# EAGLE design P2O-001 (EAGLE 7.1.0)
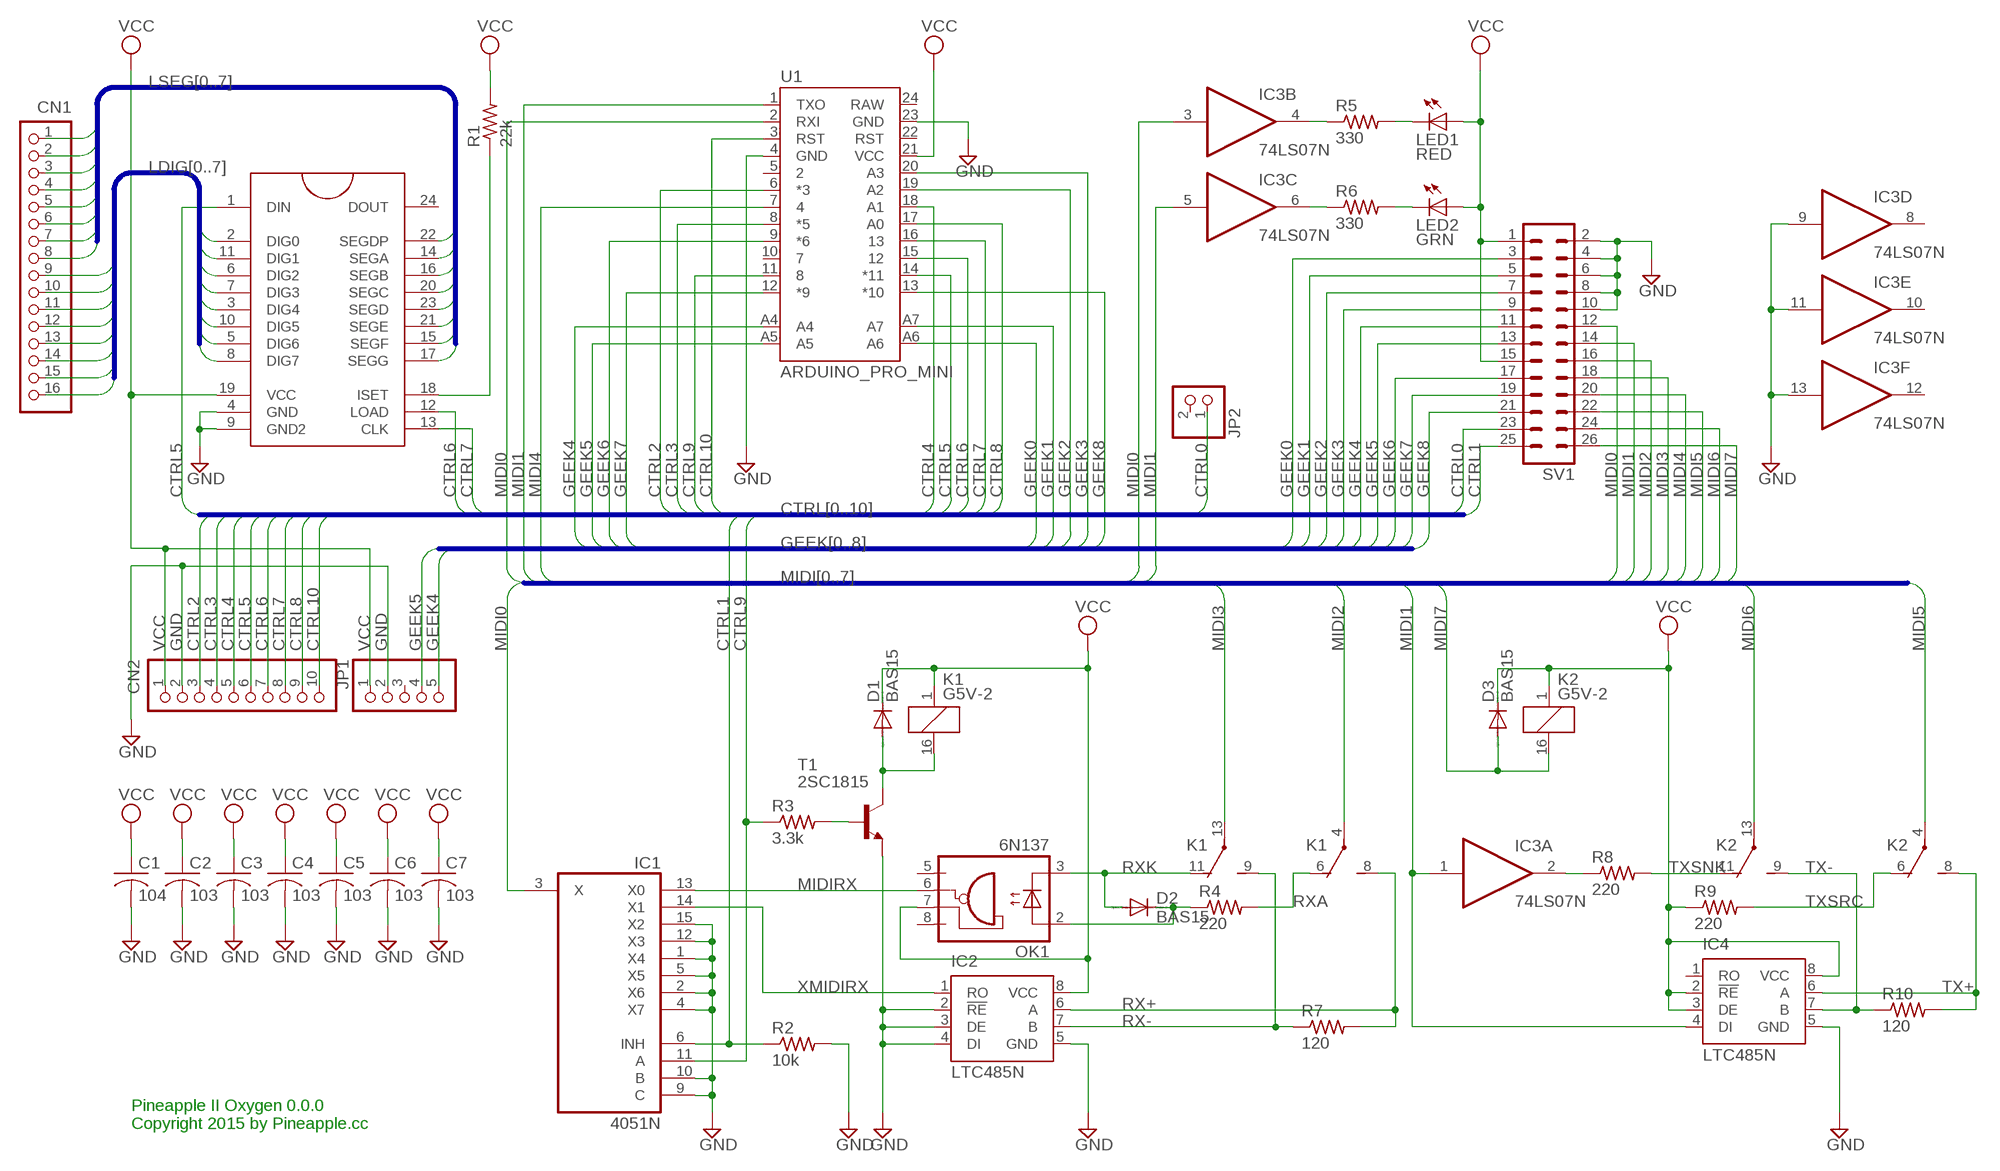
[diagram p0: schematic, sheet 1]

## Parts
C1  104  C-US025-025X050  [C025-025X050]
C2  103  C-US025-025X050  [C025-025X050]
C3  103  C-US025-025X050  [C025-025X050]
C4  103  C-US025-025X050  [C025-025X050]
C5  103  C-US025-025X050  [C025-025X050]
C6  103  C-US025-025X050  [C025-025X050]
C7  103  C-US025-025X050  [C025-025X050]
CN1  S16B-PH-K-S  [S16B-PH-K-S]
CN2  S10B-PH-K-S  [S10B-PH-K-S]
D1  BAS15  [DO34-7]
D2  BAS15  [DO34-7]
D3  BAS15  [DO34-7]
IC1  4051N  [DIL16]
IC2  LTC485N  [DIL08]
IC3  74LS07N  [DIL14]
IC4  LTC485N  [DIL08]
JP1  PINHD-1X5  [1X05]
JP2  PINHD-1X2  [1X02]
K1  G5V-2  [G5V-2]
K2  G5V-2  [G5V-2]
LED1  RED  LED3MM  [LED3MM]
LED2  GRN  LED3MM  [LED3MM]
OK1  6N137  [DIL08]
R1  22k  R-US_0204/5  [0204/5]
R2  10k  R-US_0204/5  [0204/5]
R3  3.3k  R-US_0204/5  [0204/5]
R4  220  R-US_0204/5  [0204/5]
R5  330  R-US_0204/5  [0204/5]
R6  330  R-US_0204/5  [0204/5]
R7  120  R-US_0204/5  [0204/5]
R8  220  R-US_0204/5  [0204/5]
R9  220  R-US_0204/5  [0204/5]
R10  120  R-US_0204/5  [0204/5]
SV1  ML26L  [ML26L]
T1  2SC1815  [TO92-ECB]
U1  ARDUINO_PRO_MINI  [ARDUINO_PRO_MINI]
U2  MAX7219DIP  [DIL24]

## Nets
CTRL0: JP2.1 SV1.23
CTRL1: IC1.6(INH) R2.1 SV1.25
CTRL2: CN2.3 U1.6(*3)
CTRL3: CN2.4 U1.8(*5)
CTRL4: CN2.5 U1.18(A1)
CTRL5: CN2.6 U1.14(*11) U2.1(DIN)
CTRL6: CN2.7 U1.15 U2.12(LOAD)
CTRL7: CN2.8 U1.16 U2.13(CLK)
CTRL8: CN2.9 U1.17(A0)
CTRL9: IC1.11(A) R3.1 U1.11
CTRL10: CN2.10 U1.3(RST)
GEEK0: SV1.3 U1.A6
GEEK1: SV1.5 U1.A7
GEEK2: SV1.7 U1.19(A2)
GEEK3: SV1.9 U1.20(A3)
GEEK4: JP1.5 SV1.11 U1.A4
GEEK5: JP1.4 SV1.13 U1.A5
GEEK6: SV1.17 U1.9(*6)
GEEK7: SV1.19 U1.12(*9)
GEEK8: SV1.21 U1.13(*10)
GND: C1.2 C2.2 C3.2 C4.2 C5.2 C6.2 C7.2 CN2.2 IC1.1(X4) IC1.2(X6) IC1.4(X7) IC1.5(X5) IC1.9(C) IC1.10(B) IC1.12(X3) IC1.15(X2) IC2.2(!RE) IC2.3(DE) IC2.4(DI) IC2.5(GND) IC3.9(D:I) IC3.11(E:I) IC3.13(F:I) IC4.5(GND) JP1.2 R2.2 SV1.2 SV1.4 SV1.6 SV1.8 SV1.10 T1.E U1.4(GND) U1.23(GND) U2.4(GND) U2.9(GND2)
LDIG0: CN1.9 U2.2(DIG0)
LDIG1: CN1.10 U2.11(DIG1)
LDIG2: CN1.11 U2.6(DIG2)
LDIG3: CN1.12 U2.7(DIG3)
LDIG4: CN1.13 U2.3(DIG4)
LDIG5: CN1.14 U2.10(DIG5)
LDIG6: CN1.15 U2.5(DIG6)
LDIG7: CN1.16 U2.8(DIG7)
LSEG0: CN1.1 U2.22(SEGDP)
LSEG1: CN1.2 U2.14(SEGA)
LSEG2: CN1.3 U2.16(SEGB)
LSEG3: CN1.4 U2.20(SEGC)
LSEG4: CN1.5 U2.23(SEGD)
LSEG5: CN1.6 U2.21(SEGE)
LSEG6: CN1.7 U2.15(SEGF)
LSEG7: CN1.8 U2.17(SEGG)
MIDI0: IC1.3(X) IC3.3(B:I) SV1.12 U1.2(RXI)
MIDI1: IC3.1(A:I) IC3.5(C:I) IC4.4(DI) SV1.14 U1.1(TXO)
MIDI2: K1.4(1:P) SV1.16
MIDI3: K1.13(2:P) SV1.18
MIDI4: SV1.20 U1.7
MIDI5: K2.4(1:P) SV1.22
MIDI6: K2.13(2:P) SV1.24
MIDI7: D3.A K2.16 SV1.26
MIDIRX: IC1.13(X0) OK1.6(VO)
N$1: R3.2 T1.B
N$2: IC3.2(A:O) R8.1
N$3: IC3.4(B:O) R5.1
N$4: IC3.6(C:O) R6.1
N$5: LED1.K(C) R5.2
N$6: LED2.K(C) R6.2
N$11: D1.A K1.16 T1.C
N$13: D2.C OK1.2(A) R4.1
N$21: R1.1 U2.18(ISET)
RX+: IC2.6(A) K1.8(1:S) R7.2
RX-: IC2.7(B) K1.9(2:S) R7.1
RXA: K1.6(1:O) R4.2
RXK: D2.A K1.11(2:O) OK1.3(C)
TX+: IC4.6(A) K2.8(1:S) R10.2
TX-: IC4.7(B) K2.9(2:S) R10.1
TXSNK: K2.11(2:O) R8.2
TXSRC: K2.6(1:O) R9.2
VCC: C1.1 C2.1 C3.1 C4.1 C5.1 C6.1 C7.1 CN2.1 D1.C D3.C IC2.8(VCC) IC4.2(!RE) IC4.3(DE) IC4.8(VCC) JP1.1 K1.1 K2.1 LED1.A LED2.A OK1.7(VE) R1.2 R9.1 SV1.1 SV1.15 U1.21(VCC) U2.19(VCC)
XMIDIRX: IC1.14(X1) IC2.1(RO)
Unconnected: IC3.8(D:O) IC3.10(E:O) IC3.12(F:O) IC4.1(RO) JP1.3 JP2.2 OK1.5(GND) OK1.8(VCC) U1.5 U1.10 U1.22(RST) U1.24(RAW) U2.24(DOUT)

## Buses
GEEK[0..8]
LSEG[0..7]
LDIG[0..7]
CTRL[0..10]
MIDI[0..7]

## Notes on the sheet
- Pineapple II Oxygen 0.0.0
  Copyright 2015 by Pineapple.cc

## Power pins joined to a net without a drawn wire
GND: IC1.8(GND) IC3.7(P:GND)
VCC: IC1.16(VCC) IC3.14(P:VCC)
VEE: IC1.7(VEE)

## Library data of the parts
C1-C7 = rcl:C-US: CAPACITOR, American symbol
CN1 = jst-ph:S16B-PH-*: Wire-to-Board 2.0mm pitch side mount connector Source: http://www.jst-mfg.com/product/pdf/jpn/PH.pdf http://www.jst-mfg.com/product/detail.php?series=199
CN2 = jst-ph:S10B-PH-*: Wire-to-Board 2.0mm pitch side mount connector Source: http://www.jst-mfg.com/product/pdf/jpn/PH.pdf http://www.jst-mfg.com/product/detail.php?series=199
D1-D3 = diode:BAS15: DIODE high speed
IC1 = 40xx:4051: 8-channel ANALOG MULTIPLEXER
IC2 IC4 = linear-technology:LTC485: Low Power RS485 Interface Transceiver Source: http://www.linear.com/pc/downloadDocument.do?navId=H0,C1,C1007,C1017,P2064,D1718; OC_FARNELL: unknown; OC_NEWARK: unknown
IC3 = 74xx-us:74*07: Hex BUFFER, open collector high-voltage output
JP1 = pinhead:PINHD-1X5: PIN HEADER
JP2 = pinhead:PINHD-1X2: PIN HEADER
K1 K2 = relay:G5V-2: OMRON PCB Relay Source: http://www.omron.com/ecb/products/pdf/en-g5v2.pdf; MPN: G5V-2 5DC; OC_FARNELL: 9949488; OC_NEWARK: 78K5703
LED1 LED2 = led:LED: LED OSRAM: - CHIPLED LG R971, LG N971, LY N971, LG Q971, LY Q971, LO R971, LY R971 LH N974, LH R974 LS Q976, LO Q976, LY Q976 LO Q996 - Hyper CHIPLED LW Q18S LB Q993, LB Q99A, LB R99A - SideLED LS A670, LO A670, LY A670, LG A670, LP A670 LB A673, LV A673, LT A673, LW A673 LH A674 LY A675 LS A676, LA A676, LO A676, LY A676, LW A676 LS A679, LY A679, LG A679 - Hyper Micro SIDELED® LS Y876, LA Y876, LO Y876, LY Y876 LT Y87S - SmartLED LW L88C, LW L88S LB L89C, LB L89S, LG L890 LS L89K, LO L89K, LY L89K LS L896, LA L896, LO L896, LY L896 - TOPLED LS T670, LO T670, LY T670, LG T670, LP T670 LSG T670, LSP T670, LSY T670, LOP T670, LYG T670 LG T671, LOG T671, LSG T671 LB T673, LV T673, LT T673, LW T673 LH T674 LS T676, LA T676, LO T676, LY T676, LB T676, LH T676, LSB T676, LW T676 LB T67C, LV T67C, LT T67C, LS T67K, LO T67K, LY T67K, LW E67C LS E67B, LA E67B, LO E67B, LY E67B, LB E67C, LV E67C, LT E67C LW T67C LS T679, LY T679, LG T679 LS T770, LO T770, LY T770, LG T770, LP T770 LB T773, LV T773, LT T773, LW T773 LH T774 LS E675, LA E675, LY E675, LS T675 LS T776, LA T776, LO T776, LY T776, LB T776 LHGB T686 LT T68C, LB T68C - Hyper Mini TOPLED® LB M676 - Mini TOPLED Santana® LG M470 LS M47K, LO M47K, LY M47K Source: http://www.osram.convergy.de LUXEON: - LUMILED® LXK2-PW12-R00, LXK2-PW12-S00, LXK2-PW14-U00, LXK2-PW14-V00 LXK2-PM12-R00, LXK2-PM12-S00, LXK2-PM14-U00 LXK2-PE12-Q00, LXK2-PE12-R00, LXK2-PE12-S00, LXK2-PE14-T00, LXK2-PE14-U00 LXK2-PB12-K00, LXK2-PB12-L00, LXK2-PB12-M00, LXK2-PB14-N00, LXK2-PB14-P00, LXK2-PB14-Q00 LXK2-PR12-L00, LXK2-PR12-M00, LXK2-PR14-Q00, LXK2-PR14-R00 LXK2-PD12-Q00, LXK2-PD12-R00, LXK2-PD12-S00 LXK2-PH12-R00, LXK2-PH12-S00 LXK2-PL12-P00, LXK2-PL12-Q00, LXK2-PL12-R00 Source: www.luxeon.com KINGBRIGHT: KA-3528ASYC Source: www.kingbright.com
OK1 = optocoupler:6N137: MOTOROLA OPTO COUPLER; MPN: 6N137; OC_FARNELL: 1328376; OC_NEWARK: 52M1895
R1-R10 = resistor:R-US_: RESISTOR, American symbol
SV1 = con-ml:ML26L: HARTING; OC_FARNELL: unknown; OC_NEWARK: unknown
T1 = transistor:2SC1815: NPN EPITAXIAL TRANSISTOR Source: TOSHIBA .. 2SC1815 1.pdf
U1 = SparkFun-Boards:ARDUINO_PRO_MINI
U2 = SparkFun-DigitalIC:MAX7219: 8-digit, 8-segment LED display driver, serial input

## Board
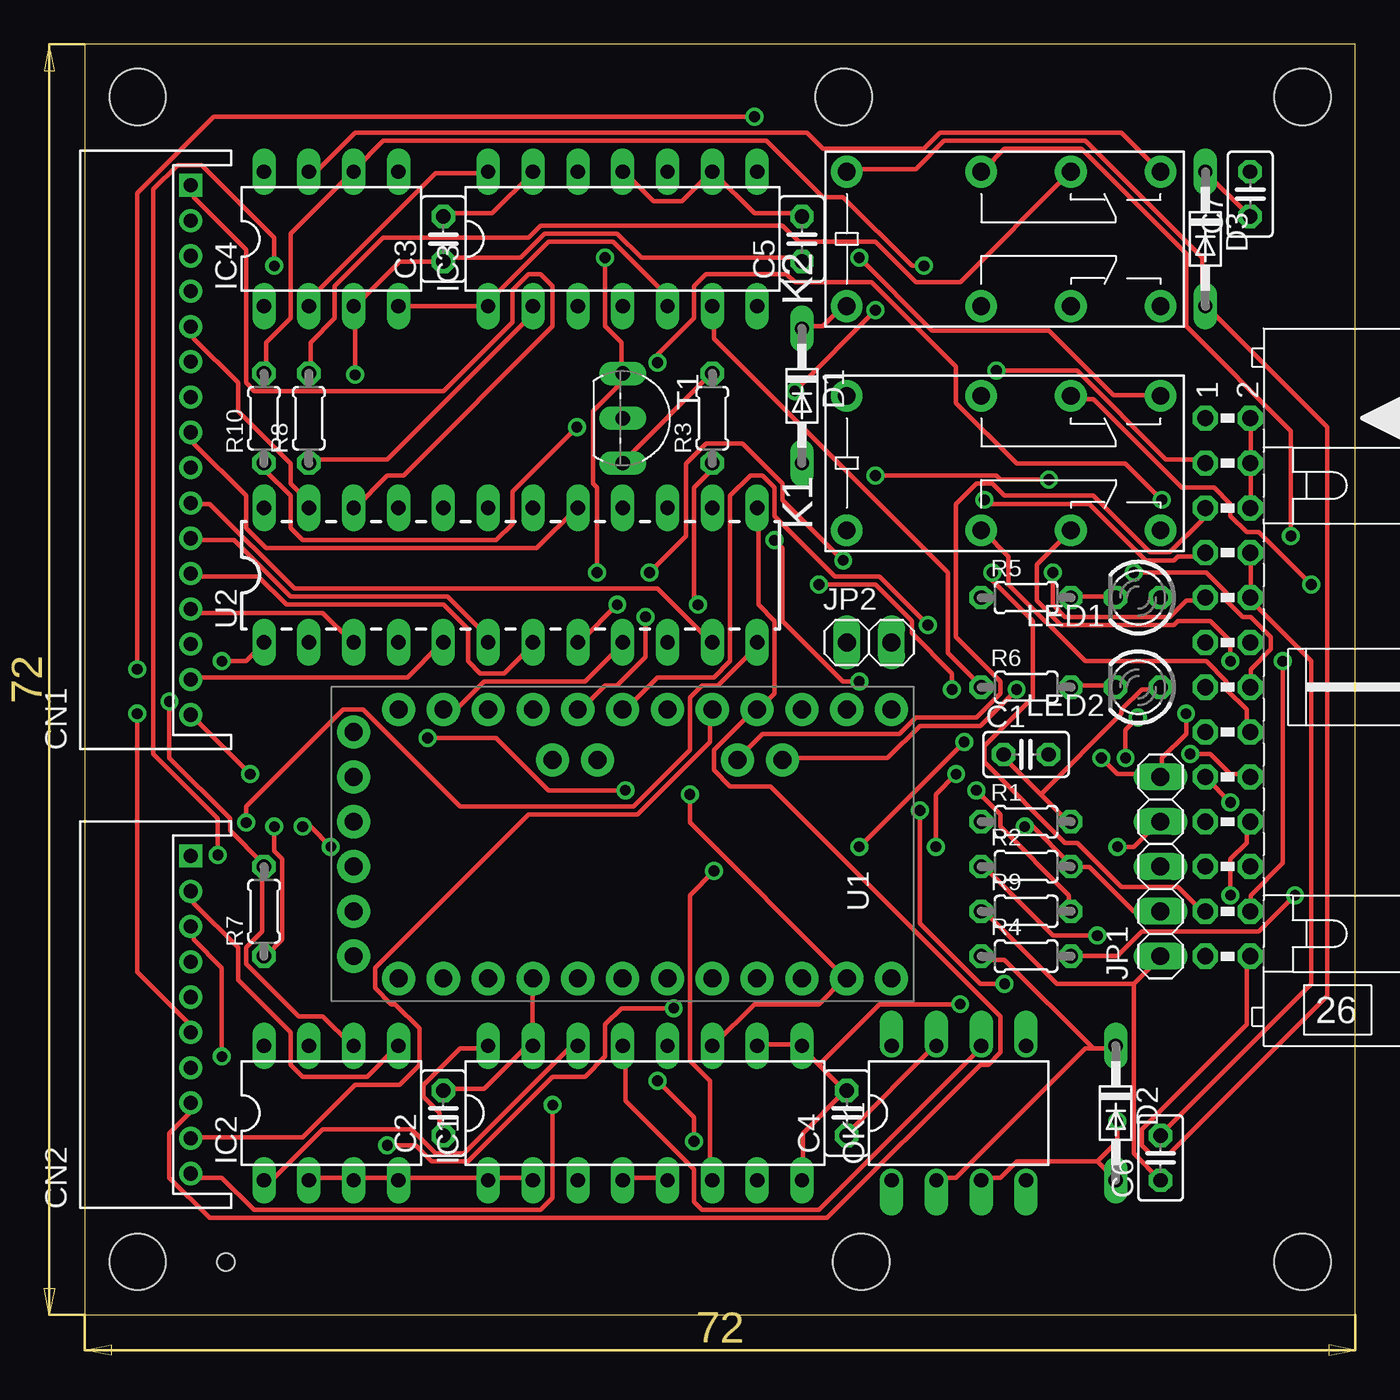
[diagram p1: board, top side]
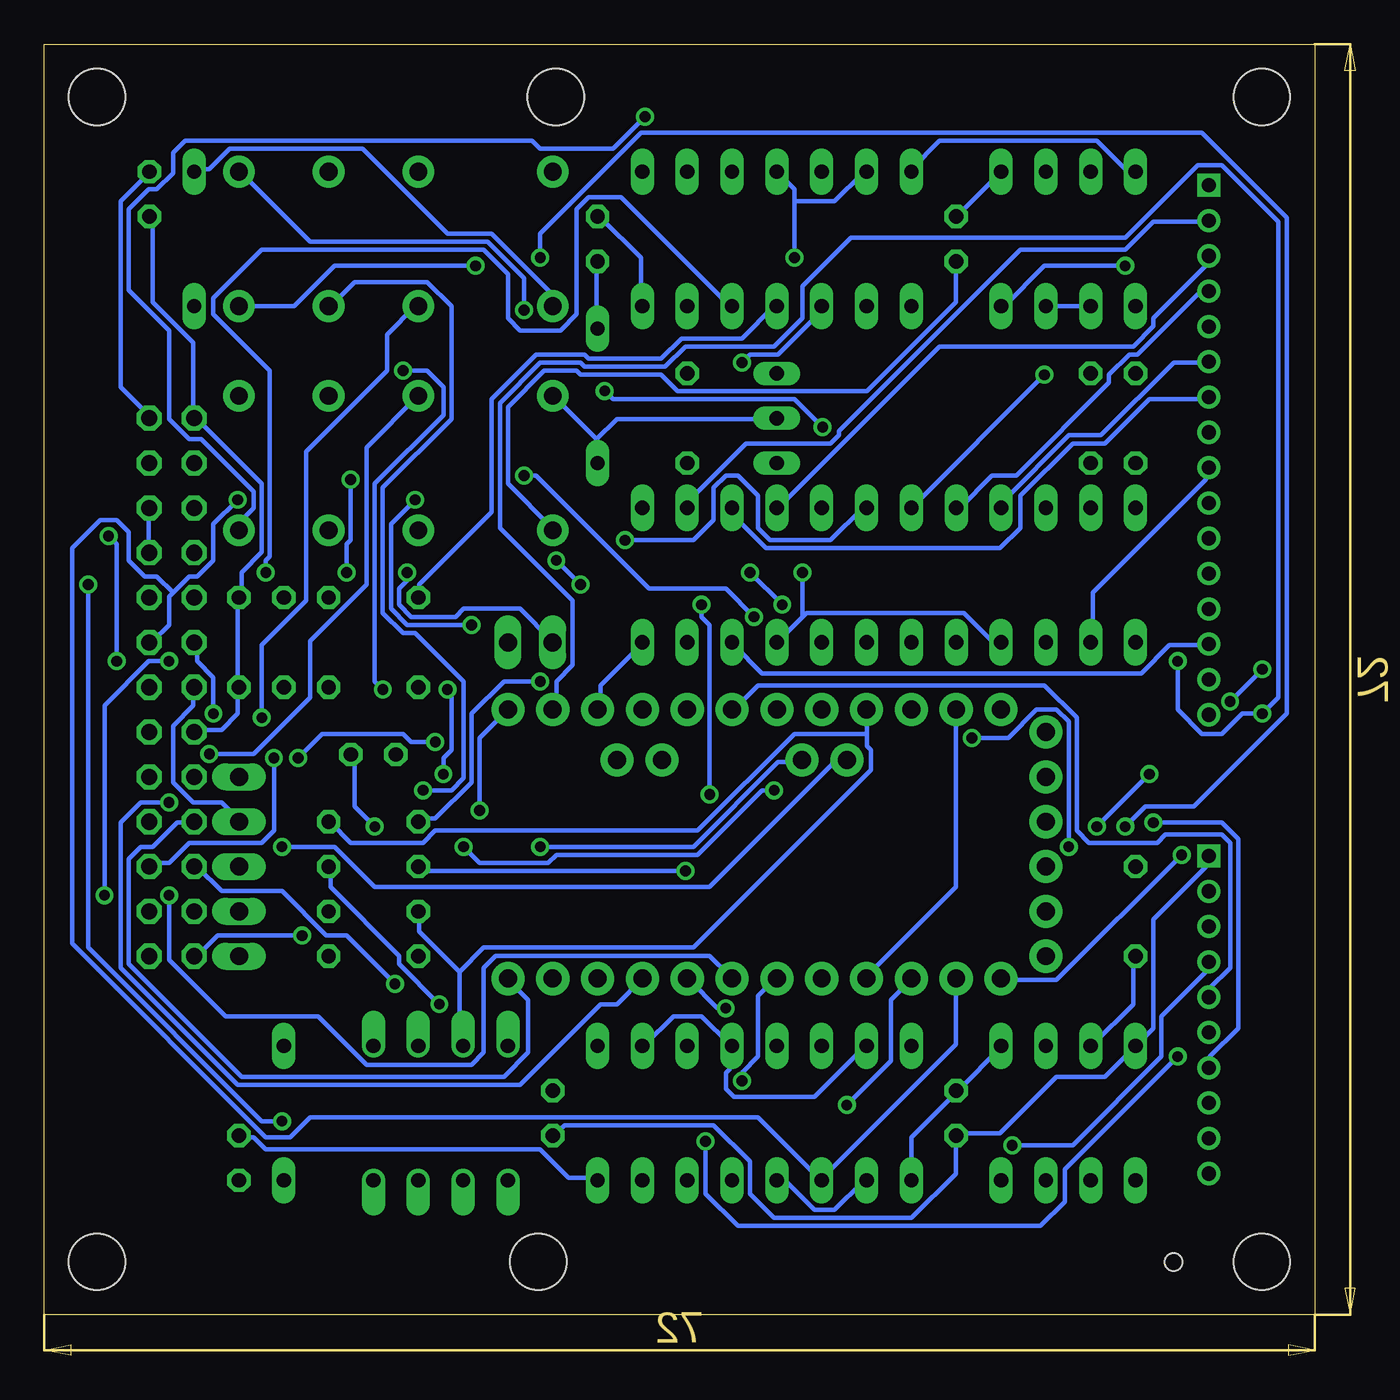
[diagram p2: board, bottom side, seen from below]

Size 72 x 72 mm. Coordinates in mm from the lower left corner, seen from the top.
Outline: 0,0 72,0 72,72 0,72 0,0
Copper layers (1*16): Top 0.035mm / dielectric 1.5mm / Bottom 0.035mm
Design rules "default": minimum track width 10mil, minimum drill 24mil, track to track 8mil, track to pad 8mil, pad to pad 8mil, via to via 8mil, smd to smd 8mil, copper to edge 40mil, drill to drill 8mil, minimum pad ring 10mil, minimum via ring 8mil, stop-mask expansion 4mil, vias tented up to drill 0mil, thermal gap 10mil
Holes 3.2 mm at 3,3 3,69 69,3 69,69 44,3 43,69
Holes 1 mm at 8,3

### Footprints (pad centres in the part's own frame; a part is rotated, then mirrored left to right if it is on the bottom)
C025-025X050 = drill 0.813 octagon: 1 -1.27,0; 2 1.27,0
S16B-PH-K-S = drill 0.8 square: 1 15,0 | drill 0.8: 2 13,0; 3 11,0; 4 9,0; 5 7,0; 6 5,0; 7 3,0; 8 1,0; 9 -1,0; 10 -3,0; 11 -5,0; 12 -7,0; 13 -9,0; 14 -11,0; 15 -13,0; 16 -15,0
S10B-PH-K-S = drill 0.8 square: 1 9,0 | drill 0.8: 2 7,0; 3 5,0; 4 3,0; 5 1,0; 6 -1,0; 7 -3,0; 8 -5,0; 9 -7,0; 10 -9,0
DO34-7 = drill 0.813 long: A 3.81,0; C -3.81,0
DIL16 = drill 0.813 long: 1 -8.89,-3.81; 2 -6.35,-3.81; 3 -3.81,-3.81; 4 -1.27,-3.81; 5 1.27,-3.81; 6 3.81,-3.81; 7 6.35,-3.81; 8 8.89,-3.81; 9 8.89,3.81; 10 6.35,3.81; 11 3.81,3.81; 12 1.27,3.81; 13 -1.27,3.81; 14 -3.81,3.81; 15 -6.35,3.81; 16 -8.89,3.81
DIL08 = drill 0.813 long: 1 -3.81,-3.81; 2 -1.27,-3.81; 3 1.27,-3.81; 4 3.81,-3.81; 5 3.81,3.81; 6 1.27,3.81; 7 -1.27,3.81; 8 -3.81,3.81
DIL14 = drill 0.813 long: 1 -7.62,-3.81; 2 -5.08,-3.81; 3 -2.54,-3.81; 4 0,-3.81; 5 2.54,-3.81; 6 5.08,-3.81; 7 7.62,-3.81; 8 7.62,3.81; 9 5.08,3.81; 10 2.54,3.81; 11 0,3.81; 12 -2.54,3.81; 13 -5.08,3.81; 14 -7.62,3.81
1X05 = drill 1.016 long: 1 -5.08,0; 2 -2.54,0; 3 0,0; 4 2.54,0; 5 5.08,0
1X02 = drill 1.016 long: 1 -1.27,0; 2 1.27,0
G5V-2 = drill 1 pad 1.8: 1 -8.89,-3.81; 4 -1.27,-3.81; 6 3.81,-3.81; 8 8.89,-3.81; 9 8.89,3.81; 11 3.81,3.81; 13 -1.27,3.81; 16 -8.89,3.81
LED3MM = drill 0.813 octagon: A -1.27,0; K 1.27,0
DIL08' = drill 0.813 offset: 1 -3.81,-3.81; 2 -1.27,-3.81; 3 1.27,-3.81; 4 3.81,-3.81; 5 3.81,3.81; 6 1.27,3.81; 7 -1.27,3.81; 8 -3.81,3.81
0204/5 = drill 0.813 octagon: 1 -2.54,0; 2 2.54,0
ML26L = drill 0.914 octagon: 1 -15.24,-1.27; 2 -15.24,1.27; 3 -12.7,-1.27; 4 -12.7,1.27; 5 -10.16,-1.27; 6 -10.16,1.27; 7 -7.62,-1.27; 8 -7.62,1.27; 9 -5.08,-1.27; 10 -5.08,1.27; 11 -2.54,-1.27; 12 -2.54,1.27; 13 0,-1.27; 14 0,1.27; 15 2.54,-1.27; 16 2.54,1.27; 17 5.08,-1.27; 18 5.08,1.27; 19 7.62,-1.27; 20 7.62,1.27; 21 10.16,-1.27; 22 10.16,1.27; 23 12.7,-1.27; 24 12.7,1.27; 25 15.24,-1.27; 26 15.24,1.27
TO92-ECB = drill 0.813 long: B 2.54,0; C 0,0; E -2.54,0
ARDUINO_PRO_MINI = drill 1.016 pad 1.88: 1 -7.62,12.7; 2 -7.62,10.16; 3 -7.62,7.62; 4 -7.62,5.08; 5 -7.62,2.54; 6 -7.62,0; 7 -7.62,-2.54; 8 -7.62,-5.08; 9 -7.62,-7.62; 10 -7.62,-10.16; 11 -7.62,-12.7; 12 -7.62,-15.24; 13 7.62,-15.24; 14 7.62,-12.7; 15 7.62,-10.16; 16 7.62,-7.62; 17 7.62,-5.08; 18 7.62,-2.54; 19 7.62,0; 20 7.62,2.54; 21 7.62,5.08; 22 7.62,7.62; 23 7.62,10.16; 24 7.62,12.7; A4 4.763,1.429; A5 4.763,3.969; A6 4.763,-9.049; A7 4.763,-6.509; BLK -6.35,15.24; GND -3.81,15.24; GRN 6.35,15.24; RXI 1.27,15.24; TXO 3.81,15.24; VCC -1.27,15.24
DIL24 = drill 0.813 long: 1 -13.97,-3.81; 2 -11.43,-3.81; 3 -8.89,-3.81; 4 -6.35,-3.81; 5 -3.81,-3.81; 6 -1.27,-3.81; 7 1.27,-3.81; 8 3.81,-3.81; 9 6.35,-3.81; 10 8.89,-3.81; 11 11.43,-3.81; 12 13.97,-3.81; 13 13.97,3.81; 14 11.43,3.81; 15 8.89,3.81; 16 6.35,3.81; 17 3.81,3.81; 18 1.27,3.81; 19 -1.27,3.81; 20 -3.81,3.81; 21 -6.35,3.81; 22 -8.89,3.81; 23 -11.43,3.81; 24 -13.97,3.81

### Placement (x,y rotation side)
C1  53.34,31.75 0 top
C2  20.32,11.43 90 top
C3  20.32,60.96 90 top
C4  43.18,11.43 90 top
C5  40.64,60.96 90 top
C6  60.96,8.89 90 top
C7  66.04,63.5 90 top
CN1  6,49 90 top
CN2  6,17 90 top
D1  40.64,52.07 270 top
D2  58.42,11.43 270 top
D3  63.5,60.96 270 top
IC1  31.75,11.43 0 top
IC2  13.97,11.43 0 top
IC3  30.48,60.96 0 top
IC4  13.97,60.96 0 top
JP1  60.96,25.4 90 top
JP2  44.45,38.1 0 top
K1  52.07,48.26 0 top
K2  52.07,60.96 0 top
LED1  59.69,40.64 180 top
LED2  59.69,35.56 180 top
OK1  6N137  [DIL08']  49.53,11.43 0 top
R1  53.34,27.94 0 top
R2  53.34,25.4 0 top
R3  35.56,50.8 90 top
R4  53.34,20.32 0 top
R5  53.34,40.64 0 top
R6  53.34,35.56 0 top
R7  10.16,22.86 90 top
R8  12.7,50.8 90 top
R9  53.34,22.86 0 top
R10  10.16,50.8 90 top
SV1  64.77,35.56 270 top
T1  30.48,50.8 270 top
U1  30.48,26.67 90 top
U2  24.13,41.91 0 top

### Tracks (layer width: path | path; a pad name or v marks a point on that pad's centre or on a via)
CTRL0  (via drill 0.61)
  Top 0.254: v51.44,42.06 51.44,41.6 53.72,39.32 53.72,34.98 50.98,32.23 50.98,31.32 55.55,26.75 56.24,26.75 58.75,24.23 61.95,24.23 63.32,22.86 SV1.23
  Bottom 0.254: v51.44,42.06 51.44,41.6 51.89,41.15 51.89,40.23 51.21,39.55 48.69,39.55 48.23,40.01 45.03,40.01 43.2,38.18 JP2.1
CTRL1  (via drill 0.61)
  Top 0.254: v35.66,25.15 34.29,23.77 34.29,14.4 35.43,13.26 35.43,7.77 IC1.6 | v57.38,21.49 54.86,21.49 50.98,25.38 R2.1
  Bottom 0.254: v35.66,25.15 50.52,25.15 50.75,25.38 R2.1 | v57.38,21.49 62.18,21.49 63.32,20.34 SV1.25
CTRL2  (via drill 0.61)
  Top 0.254: v7.77,14.63 7.77,19.66 6.17,21.26 6.17,21.95 CN2.3 | v34.52,9.83 34.52,11.2 v32.46,13.26
  Bottom 0.254: v7.77,14.63 14.17,8.23 14.17,6.4 15.54,5.03 32.69,5.03 34.52,6.86 v34.52,9.83 | v32.46,13.26 32.46,13.72 31.55,14.63 31.55,18.06 30.63,18.97 U1.6
CTRL3  (via drill 0.61)
  Top 0.254: v17.14,9.6 18.75,9.6 19.66,8.69 21.72,8.69 26.52,13.49 28.35,13.49 29.49,14.63 29.49,16.46 30.4,17.37 v33.38,17.37
  Bottom 0.254: v17.14,9.6 13.72,9.6 8.69,14.63 8.69,16.92 6.17,19.43 6.17,19.89 CN2.4 | v33.38,17.37 33.83,17.37 35.43,18.97 U1.8
CTRL4
  Bottom 0.254: CN2.5 5.94,18.06 5.94,18.52 4.8,19.66 4.8,26.75 5.26,27.2 8.46,27.2 8.91,26.75 12.8,26.75 13.49,27.43 13.49,33.83 15.32,35.66 31.55,35.66 32.92,34.29 U1.18
CTRL5  (via drill 0.61)
  Top 0.254: v2.97,34.06 2.97,19.43 5.94,16.46 5.94,16 CN2.6 | v7.77,37.03 9.14,37.03 10.06,37.95 U2.1
  Bottom 0.254: v7.77,37.03 7.77,34.29 6.4,32.92 5.26,32.92 4.12,34.06 v2.97,34.06 2.06,34.98 2.06,61.95 5.26,65.15 6.63,65.15 10.74,61.04 26.29,61.04 29.03,58.29 29.03,56.46 30.63,54.86 35.66,54.86 36.8,53.72 41.38,53.72 41.6,53.95 43.89,53.95 46.18,51.66 46.18,44.58 42.06,40.46 42.06,36.8 42.98,35.89 42.98,34.29 U1.14
CTRL6  (via drill 0.61)
  Top 0.254: v9.14,27.89 9.14,28.8 14.63,34.29 15.77,34.29 21.26,28.8 31.09,28.8 34.29,32 34.29,34.98 34.98,35.66 35.89,35.66 38.18,37.95 U2.12
  Bottom 0.254: v9.14,27.89 5.26,27.89 4.34,26.98 4.34,16.23 5.94,14.63 5.94,14.17 CN2.7 | U1.15 40.46,34.29 40.46,35.66 38.18,37.95 U2.12
CTRL7
  Top 0.254: CN2.8 5.94,11.89 5.94,11.43 4.8,10.29 4.8,7.77 7.09,5.49 42.06,5.49 50.75,14.17 51.21,14.17 51.89,14.86 51.89,16.92 38.86,29.95 36.58,29.95 35.66,30.86 35.66,32 37.95,34.29 U1.16 38.18,34.29 39.09,35.2 39.09,39.32 38.18,40.23 38.18,45.72 U2.13
CTRL8
  Top 0.254: CN2.9 6.17,10.06 12.34,10.06 15.32,13.03 17.83,13.03 18.97,14.17 18.97,16.23 17.6,17.6 17.37,17.6 16.46,18.52 16.46,19.66 25.15,28.35 31.32,28.35 35.43,32.46 35.43,34.29 U1.17
CTRL9  (via drill 0.61)
  Top 0.254: IC1.11 35.66,15.32 37.95,17.6 41.6,17.6 42.98,18.97 U1.11 42.98,19.2 34.29,27.89 v34.29,29.49 | v34.75,40.23 34.52,40.46 34.52,46.86 35.43,47.78 35.43,48.23 R3.1
  Bottom 0.254: v34.75,40.23 34.75,39.55 34.29,39.09 v34.29,29.49
CTRL10  (via drill 0.61)
  Top 0.254: v26.52,11.89 26.52,6.63 25.83,5.94 9.6,5.94 7.77,7.77 6.17,7.77 CN2.10
  Bottom 0.254: v26.52,11.89 24,14.4 24,17.83 22.86,18.97 U1.3
GEEK0  (via drill 0.61)
  Top 0.254: v51.66,53.49 56.24,53.49 61.27,48.46 63.32,48.46 SV1.3 | v52.81,35.43 50.75,33.38 47.32,33.38 45.49,31.55 39.55,31.55 U1.A6
  Bottom 0.254: v51.66,53.49 50.29,53.49 49.38,52.58 49.38,50.98 53.26,47.09 53.26,35.89 v52.81,35.43
GEEK1
  Top 0.254: SV1.5 63.32,45.72 63.32,45.03 61.49,43.2 60.35,43.2 57.15,46.41 52.12,46.41 51.44,47.09 50.52,47.09 49.38,45.95 49.38,38.41 51.89,35.89 51.89,35.2 50.52,33.83 47.09,33.83 46.18,32.92 38.41,32.92 37.03,31.55 U1.A7
GEEK2  (via drill 0.61)
  Top 0.254: v50.98,46.18 51.21,45.95 56.92,45.95 60.12,42.75 61.72,42.75 61.95,42.98 63.32,42.98 SV1.7 | v47.78,39.09 45.03,41.83 42.52,41.83 39.09,45.26 39.09,46.86 38.41,47.55 37.72,47.55 36.58,46.41 36.58,37.03 35.66,36.12 32.46,36.12 30.63,34.29 U1.19
  Bottom 0.254: v50.98,46.18 52.35,44.81 52.35,40.01 51.44,39.09 v47.78,39.09
GEEK3  (via drill 0.61)
  Top 0.254: v54.86,42.06 54.86,40.23 55.55,39.55 61.49,39.55 62.41,40.46 63.32,40.46 SV1.9 | v54.63,47.32 51.89,47.32 51.66,47.55 v44.81,47.55 | v31.77,39.55 31.77,37.26 30.18,35.66 29.49,35.66 28.12,34.29 U1.20
  Bottom 0.254: v54.86,42.06 54.86,43.66 54.63,43.89 v54.63,47.32 | v44.81,47.55 44.12,47.55 37.72,41.15 33.38,41.15 v31.77,39.55
GEEK4  (via drill 0.61)
  Top 0.254: v62.41,34.06 62.41,32.92 61.04,31.55 61.04,30.63 JP1.5 60.81,30.63 58.52,30.63 v57.61,31.55 | v49.84,32.46 v43.89,26.52
  Bottom 0.254: v62.41,34.06 62.41,36.12 63.32,37.03 63.32,37.95 SV1.11 | v43.89,26.52 35.2,26.52 30.4,31.32 29.26,31.32 U1.A4 | v49.84,32.46 51.21,32.46 51.66,32.92 56.24,32.92 v57.61,31.55
GEEK5  (via drill 0.61)
  Top 0.254: v58.52,26.52 59.44,26.52 60.81,27.89 JP1.4
  Bottom 0.254: SV1.13 63.55,35.43 63.55,34.52 64.69,33.38 64.69,30.18 63.55,29.03 61.95,29.03 61.04,28.12 JP1.4 | v58.52,26.52 55.55,26.52 53.26,24.23 34.29,24.23 27.2,31.32 26.52,31.32 U1.A5
GEEK6  (via drill 0.61)
  Top 0.254: v64.92,29.03 63.55,30.4 SV1.17
  Bottom 0.254: v64.92,29.03 66.52,29.03 67.67,27.89 67.67,19.66 61.04,13.03 45.03,13.03 40.46,17.6 39.55,17.6 U1.9
GEEK7
  Bottom 0.254: SV1.19 63.55,27.89 64.47,27.89 65.84,26.52 66.52,26.52 67.21,25.83 67.21,19.89 60.81,13.49 45.95,13.49 44.58,14.86 44.58,17.83 45.72,18.97 U1.12
GEEK8  (via drill 0.61)
  Top 0.254: v52.12,18.75 50.75,18.75 47.32,22.17 v47.32,28.57
  Bottom 0.254: v52.12,18.75 54.86,21.49 56.01,21.49 58.52,24 61.95,24 63.32,25.38 SV1.21 | v47.32,28.57 47.32,32.69 U1.13
GND  (via drill 0.61)
  Top 0.254: SV1.8 66.06,42.98 66.06,40.69 SV1.10 66.06,40.46 69.49,37.03 69.49,18.75 61.04,10.29 C6.2 | SV1.6 66.06,45.72 66.06,48.23 SV1.4 66.06,48.46 66.06,50.75 SV1.2 | JP1.2 59.44,22.86 56.92,25.38 56.01,25.38 R2.2 55.78,25.6 53.72,27.66 v53.26,27.66 | IC1.10 38.18,15.32 40.46,15.32 IC1.9 40.69,15.09 41.6,14.17 | IC1.8 40.69,7.77 40.69,10.29 42.98,12.57 C4.2 42.98,12.8 41.6,14.17 | v49.61,17.6 45.03,17.6 41.6,14.17 | C5.2 40.46,62.41 37.95,62.41 35.66,64.69 IC3.9 35.43,64.69 33.83,63.09 32.23,63.09 30.63,64.69 IC3.11 | v29.49,59.89 29.49,56.01 30.4,55.09 30.4,53.49 T1.E 30.4,53.26 30.4,52.81 28.8,51.21 28.8,47.09 29.03,46.86 v29.03,42.06 | C3.2 20.34,62.41 23.09,62.41 25.38,64.69 IC3.13 | IC1.4 30.63,7.77 32.92,7.77 IC1.5 | 22.86,7.77 25.38,7.77 IC1.2 | IC2.2 12.8,7.77 15.09,7.77 IC2.3 15.32,7.77 17.6,7.77 IC2.4 17.83,7.77 22.86,7.77 | 22.86,7.77 IC1.1 | U1.23 21.03,34.29 22.63,35.89 28.35,35.89 30.4,37.95 U2.9 | U1.4 25.38,18.97 25.38,15.32 IC1.15 25.38,15.09 24.92,15.09 22.63,12.8 20.34,12.8 C2.2 | CN2.2 6.17,23.77 6.17,23.32 8.69,20.8 8.69,18.97 11.66,16 11.66,14.17 12.34,13.49 16,13.49 17.6,15.09 IC2.5
  Bottom 0.254: SV1.8 66.06,43.2 66.06,45.72 SV1.6 | C7.2 66.06,64.69 67.67,63.09 67.67,52.58 66.06,50.98 SV1.2 | v53.26,27.66 54.41,28.8 54.41,31.55 C1.2 | IC1.10 37.95,15.32 36.35,16.92 34.75,16.92 33.15,15.32 IC1.12 33.15,15.09 33.15,13.95 33.38,13.72 33.38,12.8 32.92,12.34 28.35,12.34 25.6,15.09 IC1.15 | C6.2 60.81,10.06 60.12,10.06 59.44,9.37 43.89,9.37 42.29,7.77 40.69,7.77 IC1.8 | v49.61,17.6 51.89,19.89 51.89,20.34 55.78,24.23 55.78,25.38 R2.2 | IC3.7 38.18,57.15 38.18,59.89 40.46,62.18 C5.2 | IC4.5 17.83,64.69 20.12,62.41 C3.2 | 29.49,63.09 29.49,63.78 IC3.11 | 29.49,63.09 v29.49,59.89 | 29.49,63.09 27.2,63.09 25.6,64.69 IC3.13 | IC1.4 30.4,7.54 29.95,7.54 28.35,5.94 27.2,5.94 25.6,7.54 IC1.2 | U2.9 29.03,39.55 | 29.03,39.55 28.8,39.78 19.89,39.78 18.29,38.18 17.83,38.18 U2.4 | IC2.5 17.83,15.09 20.12,12.8 C2.2 20.34,12.57 22.86,10.06 IC1.1 | U1.23 20.34,34.29 20.34,24.23 25.38,19.2 U1.4 | 29.03,39.55 v29.03,42.06
LDIG0
  Bottom 0.254: CN1.9 6.17,47.78 6.17,47.32 12.57,40.92 12.57,38.18 U2.2
LDIG1
  Top 0.254: CN1.10 6.17,45.95 7.09,45.95 11.89,41.15 32.46,41.15 35.43,38.18 U2.11
LDIG2
  Top 0.254: U2.6 22.86,38.41 20.57,40.69 11.66,40.69 8.46,43.89 6.17,43.89 CN1.11
LDIG3
  Top 0.254: CN1.12 6.17,41.83 9.83,41.83 11.43,40.23 20.34,40.23 21.72,38.86 21.72,37.03 22.4,36.35 23.77,36.35 25.38,37.95 U2.7
LDIG4
  Top 0.254: CN1.13 6.17,39.78 13.49,39.78 15.09,38.18 U2.3
LDIG5
  Bottom 0.254: CN1.14 6.17,37.95 8.23,37.95 9.83,36.35 31.32,36.35 32.92,37.95 U2.10
LDIG6
  Top 0.254: CN1.15 6.17,36.12 18.29,36.12 20.12,37.95 U2.5
LDIG7  (via drill 0.61)
  Top 0.254: v9.37,30.63 6.17,33.83 CN1.16 | v12.34,27.66 12.8,27.66 v13.95,26.52 | v19.43,32.69 23.32,32.69 26.29,29.72 v30.63,29.72 | v48.23,26.52 48.23,29.49 v49.38,30.63 | v49.15,35.43 49.15,36.35 46.86,38.63 46.86,39.32 44.81,41.38 v41.6,41.38 | v42.98,42.75 39.55,46.18 39.55,47.09 37.26,49.38 35.2,49.38 34.06,48.23 34.06,44.12 v32,42.06 | v30.18,40.23 28.12,38.18 U2.8
  Bottom 0.254: v12.34,27.66 v9.37,30.63 | v13.95,26.52 13.95,33.6 14.63,34.29 15.77,34.29 17.37,32.69 v19.43,32.69 | v30.63,29.72 31.32,29.72 34.98,26.06 42.98,26.06 43.43,25.6 47.32,25.6 v48.23,26.52 | v49.38,30.63 49.38,31.55 48.92,32 48.92,35.2 v49.15,35.43 | v42.98,42.75 v41.6,41.38 | v30.18,40.23 v32,42.06
LSEG0
  Top 0.254: CN1.1 6.17,63.78 6.17,63.32 9.14,60.35 9.14,52.81 9.6,52.35 20.34,52.35 24.23,56.24 24.23,58.06 25.15,58.98 25.83,58.98 26.52,58.29 26.52,56.01 18.06,47.55 17.14,47.55 15.32,45.72 U2.22
LSEG1
  Bottom 0.254: CN1.2 6.17,61.95 9.14,61.95 10.74,60.35 16.69,60.35 26.98,50.06 26.98,49.84 27.43,49.38 32.23,49.38 35.43,46.18 35.43,45.72 U2.14
LSEG2
  Bottom 0.254: CN1.3 6.17,59.89 6.17,59.44 9.14,56.46 9.14,56.01 10.29,54.86 21.26,54.86 30.4,45.72 U2.16
LSEG3
  Bottom 0.254: CN1.4 6.17,57.84 6.63,57.84 10.06,54.41 10.52,54.41 11.66,53.26 11.66,52.81 16.92,47.55 18.29,47.55 20.12,45.72 U2.20
LSEG4
  Top 0.254: CN1.5 6.17,55.78 6.17,55.32 8.69,52.81 8.69,51.21 11.66,48.23 11.66,47.09 12.57,46.18 12.57,45.72 U2.23
LSEG5
  Bottom 0.254: CN1.6 6.17,53.95 8,53.95 12.12,49.84 13.95,49.84 17.6,46.18 17.6,45.72 U2.21
LSEG6
  Bottom 0.254: CN1.7 6.17,51.89 9.37,51.89 11.89,49.38 13.72,49.38 16.69,46.41 16.69,44.58 17.83,43.43 31.09,43.43 32.92,45.26 32.92,45.72 U2.15
LSEG7
  Top 0.254: CN1.8 6.17,49.84 6.17,49.38 9.14,46.41 9.14,44.58 10.29,43.43 25.6,43.43 27.89,45.72 U2.17
MIDI0  (via drill 0.61)
  Top 0.254: v32.46,53.95 32.46,54.41 34.52,56.46 34.52,58.29 35.2,58.98 39.78,58.98 40.23,58.52 44.58,58.52 49.38,53.72 49.38,51.66 52.81,48.23 58.98,48.23 v61.04,46.18
  Bottom 0.254: U1.2 20.34,18.97 20.34,15.32 27.89,7.77 IC1.3 28.12,7.77 31.55,11.2 56.92,11.2 58.06,10.06 59.44,10.06 70.41,21.03 70.41,43.43 68.81,45.03 67.89,45.03 67.21,44.35 67.21,42.75 66.29,41.83 65.61,41.83 64.69,40.92 | v32.46,53.95 32,54.41 30.4,54.41 28.12,56.69 28.12,57.15 IC3.3 | v61.04,46.18 62.41,44.81 62.41,42.75 63.32,41.83 63.78,41.83 64.69,40.92 | 64.69,40.92 64.92,40.69 64.92,39.09 65.84,38.18 SV1.12
MIDI1  (via drill 0.61)
  Top 0.254: 22.63,57.15 IC4.4 | 22.63,57.15 26.29,60.81 29.95,60.81 32.92,57.84 32.92,57.15 IC3.5 | 22.63,57.15 IC3.1 | v59.44,42.06 63.55,42.06 64.69,40.92 64.69,40.46 65.61,39.55 66.06,39.55 67.21,38.41 67.21,37.72 66.06,36.58 66.06,35.66 SV1.14 | v7.54,26.06 7.54,28.12 3.89,31.77 3.89,63.78 5.26,65.15 6.63,65.15 10.74,61.04 v10.74,59.44
  Bottom 0.254: v59.44,42.06 59.44,42.75 59.21,42.98 59.21,53.49 62.41,56.69 62.41,57.61 59.66,60.35 47.09,60.35 45.72,58.98 45.72,56.46 45.03,55.78 42.75,55.78 41.83,56.69 41.83,62.64 41.15,63.32 39.32,63.32 33.15,57.15 IC3.5 | v7.54,26.06 14.63,18.97 17.6,18.97 U1.1 | v10.74,59.44 15.32,59.44 17.6,57.15 IC4.4
MIDI2
  Top 0.254: SV1.16 65.84,33.15 65.84,34.29 64.69,35.43 64.69,35.89 63.55,37.03 56.69,37.03 52.35,41.38 52.35,42.98 50.98,44.35 K1.4
MIDI3  (via drill 0.61)
  Top 0.254: v62.64,31.77 63.78,31.77 64.92,30.63 65.84,30.63 SV1.18
  Bottom 0.254: v62.64,31.77 60.12,31.77 56.92,34.98 56.92,38.18 53.72,41.38 53.72,49.15 K1.13
MIDI4  (via drill 0.61)
  Top 0.254: v64.92,23.77 64.92,25.83 65.84,26.75 65.84,27.89 SV1.20
  Bottom 0.254: v64.92,23.77 64.92,20.12 61.72,16.92 56.46,16.92 53.72,14.17 47.78,14.17 47.09,14.86 47.09,19.66 46.41,20.34 34.29,20.34 33.15,19.2 U1.7
MIDI5  (via drill 0.61)
  Top 0.254: v58.98,31.55 58.98,33.15 v59.66,33.83
  Bottom 0.254: v58.98,31.55 58.98,27.43 59.66,26.75 63.78,26.75 64.92,25.6 65.84,25.6 SV1.22 | v59.66,33.83 59.66,37.95 57.15,40.46 57.15,48.92 52.58,53.49 52.58,55.55 50.98,57.15 K2.4
MIDI6  (via drill 0.61)
  Top 0.254: v67.89,37.03 67.89,25.6 66.06,23.77 66.06,22.86 SV1.24 | v68.35,44.12 68.35,50.06 62.41,56.01 62.41,60.12 56.46,66.06 52.12,66.06 50.98,64.92 K2.13
  Bottom 0.254: v67.89,37.03 67.89,43.66 v68.35,44.12
MIDI7
  Top 0.254: K2.16 43.2,64.92 47.09,64.92 48.69,66.52 56.69,66.52 63.32,59.89 63.32,57.15 D3.A 63.55,57.15 70.41,50.29 70.41,18.06 61.49,9.14 60.35,9.14 59.89,9.6 59.89,10.52 65.84,16.46 65.84,20.12 SV1.26
MIDIRX
  Top 0.254: IC1.13 30.63,15.09 30.63,12.12 34.52,8.23 34.52,6.4 34.98,5.94 41.6,5.94 50.75,15.09 OK1.6
N$1
  Top 0.254: T1.B 30.63,48.46 35.43,53.26 R3.2
N$2
  Top 0.254: R8.1 12.8,48.46 17.14,48.46 25.38,56.69 25.38,57.15 IC3.2
N$3
  Bottom 0.254: R5.1 50.75,40.69 50.75,41.38 46.63,45.49 46.63,51.89 44.12,54.41 41.38,54.41 41.15,54.18 37.03,54.18 35.89,55.32 32.46,55.32 30.63,57.15 IC3.4
N$4
  Top 0.254: IC3.6 35.66,57.15 35.66,55.32 48.92,42.06 48.92,37.49 50.75,35.66 R6.1
N$5
  Top 0.254: R5.2 56.01,40.69 58.29,40.69 LED1.K
N$6
  Top 0.254: R6.2 56.01,35.66 58.29,35.66 LED2.K
N$11
  Bottom 0.254: 40.69,49.61 40.69,48.46 D1.A | 40.69,49.61 42.98,51.89 K1.16 | 40.69,49.61 39.55,50.75 30.63,50.75 T1.C
N$13
  Top 0.254: 57.15,15.09 58.29,15.09 D2.C | 57.15,15.09 56.69,15.09 49.38,7.77 48.46,7.77 OK1.2 | 57.15,15.09 52.12,20.12 50.98,20.12 R4.1
N$21  (via drill 0.61)
  Top 0.254: v43.89,35.89 42.98,35.89 39.55,39.32 39.55,43.43 v39.09,43.89
  Bottom 0.254: v43.89,35.89 45.95,35.89 47.78,34.06 47.78,30.18 49.84,28.12 50.75,28.12 R1.1 | v39.09,43.89 35.2,43.89 34.06,45.03 34.06,46.86 33.38,47.55 32.69,47.55 31.55,46.41 31.55,44.58 30.86,43.89 27.43,43.89 25.6,45.72 U2.18
RX+  (via drill 0.61)
  Top 0.254: IC2.6 15.09,15.32 13.49,16.92 12.12,16.92 9.14,19.89 9.14,20.8 10.06,21.72 10.06,25.38 R7.2 10.06,25.6 8.23,27.43 8.23,28.12 4.8,31.55 v4.8,34.75 | v37.95,67.89 7.32,67.89 2.97,63.55 v2.97,36.58
  Bottom 0.254: v37.95,67.89 39.78,66.06 43.89,66.06 44.35,66.52 64.01,66.52 64.69,65.84 64.69,64.69 65.61,63.78 66.06,63.78 67.21,62.64 67.21,58.06 64.92,55.78 64.92,50.75 63.78,49.61 63.09,49.61 60.12,46.63 60.12,45.72 60.81,45.03 60.81,44.58 K1.8 | v4.8,34.75 v2.97,36.58
RX-  (via drill 0.61)
  Top 0.254: v43.89,59.89 48.01,55.78 54.63,55.78 58.29,52.12 60.81,52.12 K1.9 | v10.74,27.66 10.74,26.29 11.2,25.83 11.2,21.26 10.29,20.34 R7.1
  Bottom 0.254: R7.1 10.29,20.12 10.29,17.6 12.57,15.32 IC2.7 | v43.89,59.89 43.89,61.27 38.18,66.98 6.4,66.98 1.6,62.18 1.6,34.06 6.86,28.8 9.6,28.8 v10.74,27.66
RXA  (via drill 0.61)
  Top 0.254: v68.58,23.77 66.52,21.72 59.89,21.72 58.52,20.34 56.01,20.34 R4.2 | v64.92,37.03 64.92,38.18 63.78,39.32 61.95,39.32 61.72,39.09 55.32,39.09 53.95,40.46 53.95,42.52 K1.6
  Bottom 0.254: v68.58,23.77 68.58,34.52 66.06,37.03 v64.92,37.03
RXK  (via drill 0.61)
  Top 0.254: 57.38,8.69 52.81,8.69 51.89,7.77 50.98,7.77 OK1.3 | 57.38,8.69 58.29,7.77 D2.A | v69.49,41.38 66.52,44.35 65.84,44.35 64.92,45.26 64.92,45.95 64.01,46.86 62.18,46.86 57.15,51.89 56.01,51.89 K1.11 | v58.52,10.97 58.52,9.83 57.38,8.69
  Bottom 0.254: v69.49,41.38 69.49,20.8 59.66,10.97 v58.52,10.97
TX+  (via drill 0.61)
  Top 0.254: R10.2 10.29,53.49 10.29,55.09 11.66,56.46 11.66,61.27 15.09,64.69 IC4.6 15.32,64.92 16.92,66.52 38.63,66.52 41.83,63.32 42.98,63.32 46.86,59.44 v47.55,59.44
  Bottom 0.254: K2.8 57.84,57.15 55.55,59.44 v47.55,59.44
TX-  (via drill 0.61)
  Top 0.254: v27.89,50.29 24.23,46.63 24.23,44.81 23.32,43.89 12.34,43.89 11.66,44.58 11.66,46.41 10.29,47.78 10.29,48.23 R10.1 | v44.81,56.92 v40.23,52.35 | K2.9 58.75,66.98 48.46,66.98 47.55,66.06 41.83,66.06 40.92,66.98 15.32,66.98 13.26,64.92 12.8,64.92 IC4.7
  Bottom 0.254: v27.89,50.29 29.49,51.89 39.78,51.89 v40.23,52.35 | v44.81,56.92 44.81,58.75 46.86,60.81 56.92,60.81 60.81,64.69 K2.9
TXSNK
  Top 0.254: R8.2 12.8,53.49 12.8,55.09 14.17,56.46 14.17,58.29 16.92,61.04 25.15,61.04 25.83,61.72 39.55,61.72 40.46,60.81 44.81,60.81 47.09,58.52 49.61,58.52 55.78,64.69 K2.11
TXSRC  (via drill 0.61)
  Top 0.254: v50.52,29.72 51.89,28.35 51.89,27.66 55.78,23.77 55.78,22.86 R9.2
  Bottom 0.254: v50.52,29.72 48.92,29.72 48.23,30.4 48.23,35.89 50.98,38.63 51.66,38.63 52.81,39.78 52.81,46.86 48.92,50.75 48.92,57.15 50.29,58.52 54.41,58.52 55.78,57.15 K2.6
VCC  (via drill 0.61)
  Top 0.254: C2.1 20.12,10.29 20.12,11.43 19.2,12.34 19.2,13.03 21.26,15.09 22.86,15.09 IC1.16 | C6.1 59.44,9.14 59.44,18.75 | 59.44,18.75 60.81,20.12 JP1.1 | C4.1 43.2,10.29 48.23,15.32 OK1.7 | 59.44,18.75 55.09,18.75 50.98,22.86 R9.1 | C7.1 65.84,62.41 63.55,64.69 D3.C | 54.18,29.49 55.78,27.89 R1.2 | 54.18,29.49 52.12,31.55 C1.1 | 54.18,29.49 58.75,34.06 58.75,34.29 59.89,35.43 60.81,35.43 LED2.A | D1.C 40.69,56.01 41.83,56.01 42.98,57.15 K2.1 | 15.32,57.15 v15.32,53.26 | 15.32,57.15 17.83,59.66 20.12,59.66 C3.1 20.34,59.89 24.69,59.89 26.06,61.27 30.18,61.27 31.55,59.89 40.46,59.89 C5.1 | 15.32,57.15 IC4.3 | IC3.14 22.86,64.69 19.89,64.69 12.8,57.61 12.8,57.15 IC4.2
  Bottom 0.254: CN2.1 6.17,25.83 6.17,25.38 9.14,22.4 9.14,16.23 10.06,15.32 IC2.8 10.29,15.09 11.89,13.49 14.63,13.49 17.83,10.29 20.12,10.29 C2.1 20.34,10.06 20.34,8 22.86,5.49 30.63,5.49 32,6.86 32,8.69 34.06,10.74 42.52,10.74 42.98,10.29 C4.1 | 48.46,19.43 50.75,21.72 50.75,22.86 R9.1 | 48.46,19.43 48.46,15.32 OK1.7 | 25.38,32.92 25.38,32.23 25.15,32 25.15,30.86 35.2,20.8 47.09,20.8 48.46,19.43 | 25.38,32.92 25.38,34.29 U1.21 | C7.1 65.84,62.18 65.84,57.38 63.55,55.09 63.55,50.98 SV1.1 63.32,50.75 59.66,47.09 59.66,43.2 60.81,42.06 60.81,40.69 LED1.A 61.04,40.46 61.04,35.66 LED2.A 61.04,35.43 61.04,34.06 61.95,33.15 63.32,33.15 SV1.15 | IC4.8 10.29,64.92 10.74,64.92 12.34,66.52 21.26,66.52 22.86,64.92 IC3.14 | C5.1 40.69,59.66 40.69,56.01 D1.C | v15.32,53.26 U2.19 | IC4.3 IC4.2 | K1.1 43.2,44.58 45.72,47.09 45.72,51.44 43.66,53.49 41.83,53.49 41.6,53.26 37.03,53.26 36.12,52.35 25.38,52.35 20.34,57.38 20.34,59.66 C3.1 | D3.C 63.32,64.92 62.64,64.92 61.49,66.06 53.95,66.06 49.15,61.27 46.63,61.27 43.2,57.84 43.2,57.15 K2.1 | 25.38,32.92 29.49,32.92 34.98,27.43 49.84,27.43 50.52,26.75 54.63,26.75 55.78,27.89 R1.2
XMIDIRX
  Top 0.254: IC2.1 10.29,7.77 10.74,7.77 13.49,10.52 18.52,10.52 19.89,9.14 21.49,9.14 27.43,15.09 27.89,15.09 IC1.14

### Text on the board
Document: P2H 1.0.0